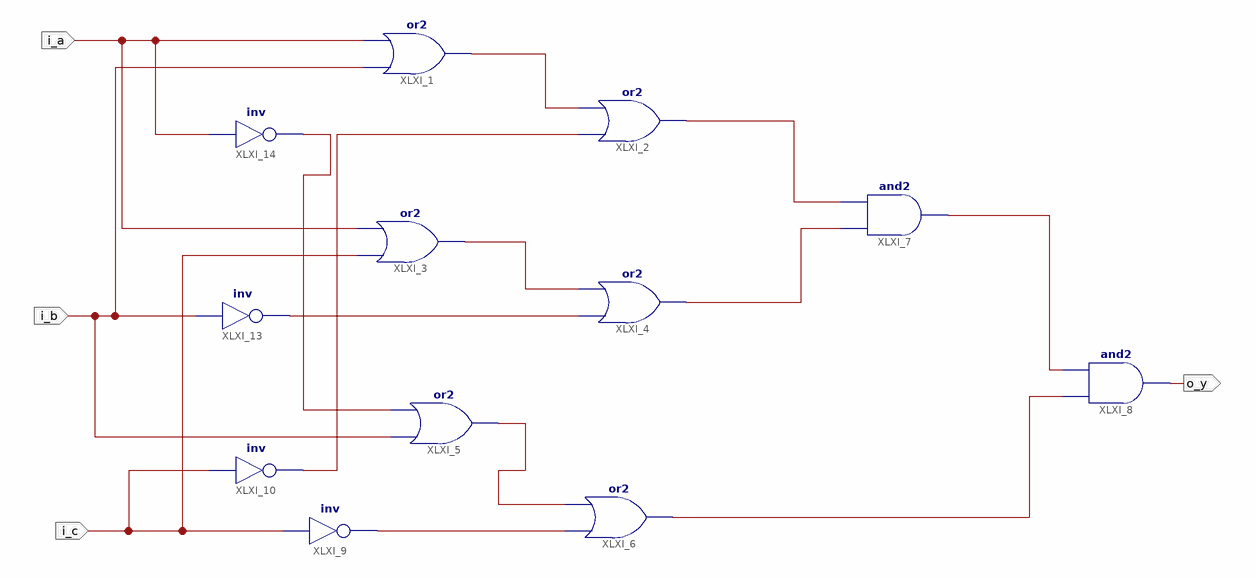
[diagram p0: schematic sheet 1]
// Xilinx ISE schematic Laby4a.sch (spartan3e) as structural Verilog: 12 symbols, 4 ports
module Laby4a (
  input  i_a,
  input  i_b,
  input  i_c,
  output o_y
);

  wire XLXN_1, XLXN_4, XLXN_5, XLXN_6, XLXN_15, XLXN_16, XLXN_17, XLXN_24, XLXN_25, XLXN_28, XLXN_29;

  or XLXI_1 (XLXN_5, i_b, i_a);
  or XLXI_2 (XLXN_16, XLXN_29, XLXN_5);
  or XLXI_3 (XLXN_6, i_c, i_a);
  or XLXI_4 (XLXN_17, XLXN_24, XLXN_6);
  or XLXI_5 (XLXN_15, i_b, XLXN_28);
  or XLXI_6 (XLXN_4, XLXN_25, XLXN_15);
  and XLXI_7 (XLXN_1, XLXN_17, XLXN_16);
  and XLXI_8 (o_y, XLXN_4, XLXN_1);
  not XLXI_9 (XLXN_25, i_c);
  not XLXI_10 (XLXN_29, i_c);
  not XLXI_13 (XLXN_24, i_b);
  not XLXI_14 (XLXN_28, i_a);
endmodule
